# Altium schematic sheet [07]-PowerSupply.SchDoc: Powersupplies (part 4 of 4)
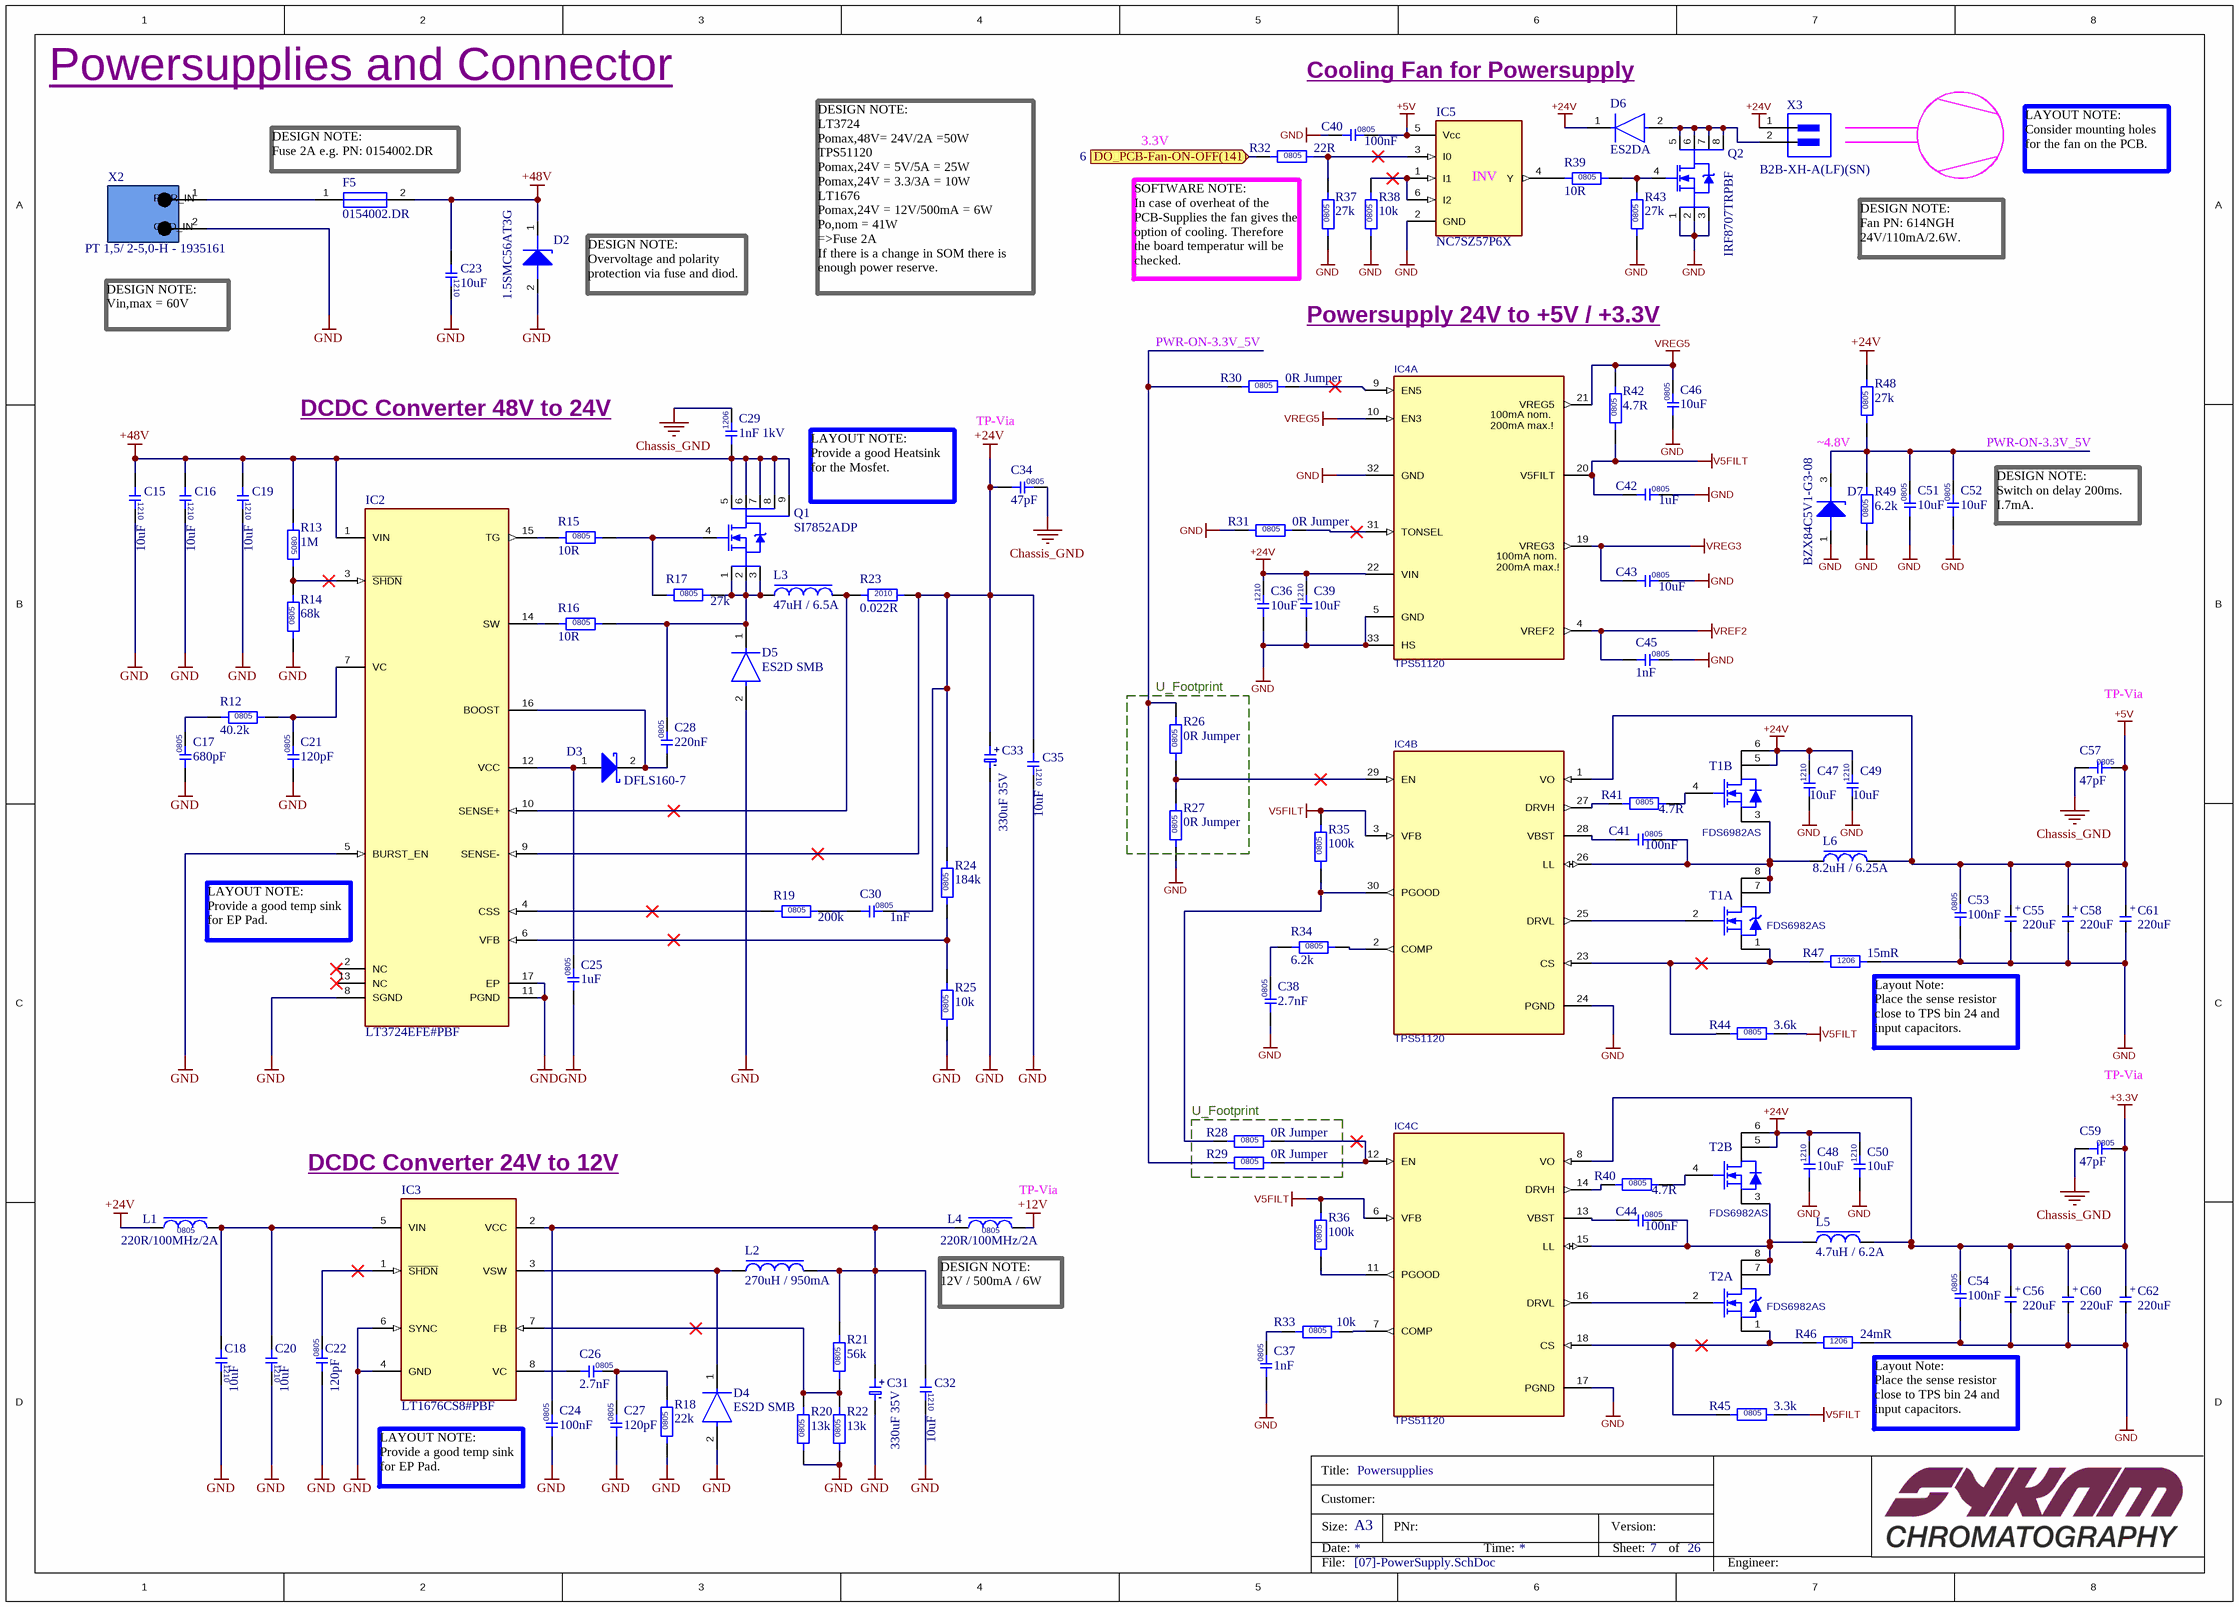
[diagram p3: [07]-PowerSupply.SchDoc]

## Library data of the parts (continued)
R40-R42 = R_4.7R_RC0805FR-074R7L: YAGEO - RC0805FR-074R7L - SMD Chip Resistor, 0805 [2012 Metric], 4.7 ohm, RC Series, 150 V, Thick Film, 125 mW; Power Rating: 125mW; Tolerance: 1%; Temperature Coefficient: 200ppm/°C; Voltage Rating: 150V; Supplier 1: Digi-Key; Manufacturer: Yageo; Manufacturer Part Number: RC0805FR-074R7L; RoHS: Yes; Category: Chip SMD Resistors; Stock 1: 232712; Pricing 1: 1=0,10000, 10=0,07200, 100=0,02770, 1000=0,01219, 2500=0,01053 (USD); Case/Package: 0805; Weight: 0.000194oz; Case Code (Imperial): 0805; Case Code (Metric): 2012; Min Operating Temperature: -55°C; Max Operating Temperature: 155°C; Packaging: Tape and Reel; Resistance: 4.7R; Max Power Dissipation: 125mW; Package Quantity: 1; Termination: SMD/SMT; Composition: Thick Film; Number of Terminations: 2; Military Standard: Not; Features: Moisture Resistant; Length: 2mm; Height: 0.5mm; Width: 1.25mm; Depth: 1.25mm; REACH SVHC: Unknown; Lead Free: Lead Free; ComponentLink1URL: https://datasheet.ciiva.com/11819/0900766b8106beab-11819877.pdf?src-supplier=RSComponents; ComponentLink1Description: https://datasheet.ciiva.com/11819/0900766b8106beab-11819877.pdf?src-supplier=RSComponents; ComponentLink2URL: https://datasheet.ciiva.com/16769/rc0805-16769447.pdf?src-supplier=Future+Electronics; ComponentLink2Description: https://datasheet.ciiva.com/16769/rc0805-16769447.pdf?src-supplier=Future+Electronics; ComponentLink3URL: https://datasheet.ciiva.com/2459/pyu-r-int-thick-7-2459640.pdf?src-supplier=Digi-Key; ComponentLink3Description: https://datasheet.ciiva.com/2459/pyu-r-int-thick-7-2459640.pdf?src-supplier=Digi-Key; ComponentLink4URL: https://datasheet.ciiva.com/2459/pyu-r-int-thick-7-2459641.pdf?src-supplier=Digi-Key; ComponentLink4Description: https://datasheet.ciiva.com/2459/pyu-r-int-thick-7-2459641.pdf?src-supplier=Digi-Key; ComponentLink5URL: https://datasheet.ciiva.com/2459/pyu-r-int-thick-7-2459642.pdf?src-supplier=Digi-Key; ComponentLink5Description: https://datasheet.ciiva.com/2459/pyu-r-int-thick-7-2459642.pdf?src-supplier=Digi-Key; Supplier Part Number 1: 311-4.70CRCT-ND
R44 = R_3.6k_RC0805FR-073K6L: RES SMD 3.6K OHM 1% 1/8W 0805; Manufacturer: Yageo; Resistance: 3.6kR; Power Rating: 125mW; Temperature Coefficient: 100ppm/°C; Voltage Rating: 150V; Supplier 1: Digi-Key; Manufacturer Part Number: RC0805FR-073K6L; RoHS: Yes; Category: Chip SMD Resistors; Stock 1: 49048; Pricing 1: 1=0,10000, 10=0,04000, 100=0,01630, 1000=0,00731, 2500=0,00635 (USD); Mount: Surface Mount; Case/Package: 0805; Case Code (Metric): 2012; Case Code (Imperial): 0805; Min Operating Temperature: -55°C; Max Operating Temperature: 155°C; Tolerance: 1%; Packaging: Tape and Reel; Composition: Thick Film; Termination: SMD/SMT; Voltage Rating (DC): 150V; Max Power Dissipation: 125mW; Number of Terminations: 2; Military Standard: Not; Package Quantity: 1; Features: Moisture Resistant; Length: 2mm; Height: 0.5mm; Width: 0.049inch; Depth: 1.25mm; Lead Free: Lead Free; ComponentLink1URL: https://datasheet.ciiva.com/11819/0900766b8106beab-11819852.pdf?src-supplier=RSComponents; ComponentLink1Description: https://datasheet.ciiva.com/11819/0900766b8106beab-11819852.pdf?src-supplier=RSComponents; ComponentLink2URL: https://datasheet.ciiva.com/15189/getdatasheetpartid-327996-15189964.pdf?src-supplier=Verical; ComponentLink2Description: https://datasheet.ciiva.com/15189/getdatasheetpartid-327996-15189964.pdf?src-supplier=Verical; ComponentLink3URL: https://datasheet.ciiva.com/2509/pyu-r-int-thick-7-2509501.pdf?src-supplier=Digi-Key; ComponentLink3Description: https://datasheet.ciiva.com/2509/pyu-r-int-thick-7-2509501.pdf?src-supplier=Digi-Key; ComponentLink4URL: https://datasheet.ciiva.com/2509/pyu-r-int-thick-7-2509502.pdf?src-supplier=Digi-Key; ComponentLink4Description: https://datasheet.ciiva.com/2509/pyu-r-int-thick-7-2509502.pdf?src-supplier=Digi-Key; ComponentLink5URL: https://datasheet.ciiva.com/17041/rc0805-17041166.pdf?src-supplier=Future+Electronics; ComponentLink5Description: https://datasheet.ciiva.com/17041/rc0805-17041166.pdf?src-supplier=Future+Electronics; ComponentLink6URL: https://datasheet.ciiva.com/2509/pyu-r-int-thick-7-2509503.pdf?src-supplier=Digi-Key; ComponentLink6Description: https://datasheet.ciiva.com/2509/pyu-r-int-thick-7-2509503.pdf?src-supplier=Digi-Key; Supplier Part Number 1: 311-3.60KCRCT-ND
R45 = R_3.3k_RC0805FR-073K3L: Res Thick Film 0805 3.3K Ohm 1% 0.125W(1/8W) ±100ppm/C Epoxy Pad SMD T/R; Manufacturer: Yageo; Resistance: 3.3kR; Temperature Coefficient: 100ppm/°C; Power Rating: 125mW; Voltage Rating: 150V; Supplier 1: Digi-Key; Manufacturer Part Number: RC0805FR-073K3L; RoHS: Yes; Category: Chip SMD Resistors; Stock 1: 73579; Pricing 1: 1=0,10000, 10=0,04000, 100=0,01630, 1000=0,00731, 2500=0,00635 (USD); Case/Package: 0805; Weight: 0.000194oz; Case Code (Metric): 2012; Case Code (Imperial): 0805; Min Operating Temperature: -55°C; Max Operating Temperature: 155°C; Tolerance: 1%; Packaging: Tape and Reel; Composition: Thick Film; Number of Terminations: 2; Termination: SMD/SMT; Package Quantity: 1; Features: Moisture Resistant; Max Power Dissipation: 125mW; Length: 2mm; Height: 0.5mm; Width: 0.049inch; Depth: 1.25mm; Lead Free: Lead Free; REACH SVHC: No SVHC; ComponentLink1URL: https://datasheet.ciiva.com/7941/444164-7941782.pdf?src-supplier=Element14; ComponentLink1Description: https://datasheet.ciiva.com/7941/444164-7941782.pdf?src-supplier=Element14; ComponentLink2URL: https://datasheet.ciiva.com/7941/444164-7941783.pdf?src-supplier=Element14; ComponentLink2Description: https://datasheet.ciiva.com/7941/444164-7941783.pdf?src-supplier=Element14; ComponentLink3URL: https://datasheet.ciiva.com/2457/pyu-r-int-thick-7-2457992.pdf?src-supplier=Digi-Key; ComponentLink3Description: https://datasheet.ciiva.com/2457/pyu-r-int-thick-7-2457992.pdf?src-supplier=Digi-Key; ComponentLink4URL: https://datasheet.ciiva.com/2457/pyu-r-int-thick-7-2457994.pdf?src-supplier=Digi-Key; ComponentLink4Description: https://datasheet.ciiva.com/2457/pyu-r-int-thick-7-2457994.pdf?src-supplier=Digi-Key; ComponentLink5URL: https://datasheet.ciiva.com/16747/rc0805-16747115.pdf?src-supplier=Future+Electronics; ComponentLink5Description: https://datasheet.ciiva.com/16747/rc0805-16747115.pdf?src-supplier=Future+Electronics; ComponentLink6URL: https://datasheet.ciiva.com/46447/444164-46447579.pdf?src-supplier=Element14; ComponentLink6Description: https://datasheet.ciiva.com/46447/444164-46447579.pdf?src-supplier=Element14; ComponentLink7URL: https://datasheet.ciiva.com/2457/pyu-r-int-thick-7-2457993.pdf?src-supplier=Digi-Key; ComponentLink7Description: https://datasheet.ciiva.com/2457/pyu-r-int-thick-7-2457993.pdf?src-supplier=Digi-Key; ComponentLink8URL: https://datasheet.ciiva.com/12577/rc0805-12577341.pdf?src-supplier=Mouser; ComponentLink8Description: https://datasheet.ciiva.com/12577/rc0805-12577341.pdf?src-supplier=Mouser; Supplier Part Number 1: 311-3.30KCRCT-ND
R46 = R_24mR_CRL1206-FV-R024ELF: Current Sense Resistors - SMD 0.024ohm 1%; Manufacturer: Bourns; Temperature Coefficient: 400ppm/°C; Power Rating: 250mW; Supplier 1: Mouser; Manufacturer Part Number: CRL1206-FV-R024ELF; RoHS: Yes; Category: Uncategorized; Case/Package: 1206; Weight: 0.000353oz; Case Code (Imperial): 1206; Case Code (Metric): 3216; Termination: SMD/SMT; Resistor Type: Thick Film; Resistance: 24mR; Packaging: Tape and Reel; Tolerance: 1%; Length: 3.2mm; Height: 0.6mm; Width: 1.6mm; ComponentLink1URL: https://datasheet.ciiva.com/5474/crl-5474006.pdf?src-supplier=Mouser; ComponentLink1Description: https://datasheet.ciiva.com/5474/crl-5474006.pdf?src-supplier=Mouser; Supplier Part Number 1: 652-CRL1206FVR024ELF
R47 = R_15mR_WSL1206R0150FEA: Res Metal Strip 1206 0.015 Ohm 1% 1/4W 75ppm/C Molded SMD SMD Embossed Plastic T/R; Manufacturer: Vishay Dale; Temperature Coefficient: 75ppm/°C; Power Rating: 250mW; Voltage Rating: 60mV; Supplier 1: Farnell; Manufacturer Part Number: WSL1206R0150FEA; RoHS: Yes; Category: Chip SMD Resistors; Stock 1: 4000; Pricing 1: 4000=0,33100 (EUR); Mount: Surface Mount; Case/Package: 1206; Number of Pins: 2; Weight: 0.000571oz; Contact Plating: Tin,Matte; Case Code (Imperial): 1206; Case Code (Metric): 3216; Min Operating Temperature: -65°C; Max Operating Temperature: 170°C; Resistance: 15mR; Tolerance: 1%; Resistor Type: Metal Strip,Metal Film; Packaging: Tape and Reel; Package Quantity: 4000; Termination: SMD/SMT; Voltage Rating (DC): 60mV; Length: 3.2mm; Height: 0.635mm; Width: 1.6mm; Depth: 1.6mm; Radiation Hardening: No; Lead Free: Lead Free; REACH SVHC: Unknown; ComponentLink1URL: https://datasheet.ciiva.com/7109/smpack-7109840.pdf?src-supplier=Newark; ComponentLink1Description: https://datasheet.ciiva.com/7109/smpack-7109840.pdf?src-supplier=Newark; ComponentLink2URL: https://datasheet.ciiva.com/5469/wsl-101914-5469061.pdf?src-supplier=Mouser; ComponentLink2Description: https://datasheet.ciiva.com/5469/wsl-101914-5469061.pdf?src-supplier=Mouser; ComponentLink3URL: https://datasheet.ciiva.com/16341/wsl-16341093.pdf?src-supplier=Future+Electronics; ComponentLink3Description: https://datasheet.ciiva.com/16341/wsl-16341093.pdf?src-supplier=Future+Electronics; ComponentLink4URL: https://datasheet.ciiva.com/17187/wsl-17187454.pdf?src-supplier=Avnet+Europe; ComponentLink4Description: https://datasheet.ciiva.com/17187/wsl-17187454.pdf?src-supplier=Avnet+Europe; Supplier Part Number 1: 2368767
T1 T2 = T-Fairchild-FDS6982AS-N: FAIRCHILD SEMICONDUCTOR   FDS6982AS   MOSFET, NN-CH, 30V, 8.6A, 8-SOIC, RL; Manufacturer: ON Semiconductor / Fairchild; PCBChecked: initials after Checked; Rise Time: 7ns; Fall Time: 3ns; Drain to Source Resistance: 11mR; Power Dissipation: 2W; Turn-Off Delay Time: 24ns; Gate to Source Voltage (Vgs): 20V; Input Capacitance: 610pF; Number of Elements: 2; Rds On Max: 28mR; Turn-On Delay Time: 12ns; Threshold Voltage: 1.9V; Nominal Vgs: 1.4V; FET Type: 2 N-Channel; Recovery Time: 19ns; Manufacturer Name: Fairchild; Manufacturer Part No.: FDS6982AS; IPC7352C: initials after Checked; SCHChecked: initials after Checked; Supplier 1: Farnell; Manufacturer Part Number: FDS6982AS; RoHS: Yes; Category: MOSFETs; Stock 1: 6507; Pricing 1: 5=0,75600, 50=0,67400, 100=0,43500, 500=0,39200, 1000=0,34800 (EUR); Mount: Surface Mount; Case/Package: SOIC; Number of Pins: 8; Weight: 0.187g; Contact Plating: Tin,Matte; Min Operating Temperature: -55°C; Max Operating Temperature: 150°C; Package Quantity: 1; Packaging: Tape and Reel; Continuous Drain Current (ID): 8.6A; Max Power Dissipation: 2W; Drain to Source Voltage (Vdss): 30V; Drain to Source Breakdown Voltage: 30V; On-State Resistance: 28MR; Voltage Rating (DC): 30V; Current Rating: 8.6A; Length: 5mm; Height: 1.5mm; Width: 3.99mm; Radiation Hardening: No; REACH SVHC: No SVHC; Lead Free: Lead Free; ComponentLink1URL: https://datasheet.ciiva.com/6386/fds6982as-6386529.pdf?src-supplier=Digi-Key; ComponentLink1Description: https://datasheet.ciiva.com/6386/fds6982as-6386529.pdf?src-supplier=Digi-Key; ComponentLink2URL: https://datasheet.ciiva.com/15137/getdatasheetpartid-60181-15137249.pdf?src-supplier=Verical; ComponentLink2Description: https://datasheet.ciiva.com/15137/getdatasheetpartid-60181-15137249.pdf?src-supplier=Verical; ComponentLink3URL: https://datasheet.ciiva.com/14170/fds6982as-eng-tds-14170930.pdf?src-supplier=Distrelec; ComponentLink3Description: https://datasheet.ciiva.com/14170/fds6982as-eng-tds-14170930.pdf?src-supplier=Distrelec; ComponentLink4URL: https://datasheet.ciiva.com/4441/fds6982as-111180-4441914.pdf?src-supplier=Mouser; ComponentLink4Description: https://datasheet.ciiva.com/4441/fds6982as-111180-4441914.pdf?src-supplier=Mouser; ComponentLink5URL: https://datasheet.ciiva.com/8114/fds6982as-8114629.pdf?src-supplier=Avnet; ComponentLink5Description: https://datasheet.ciiva.com/8114/fds6982as-8114629.pdf?src-supplier=Avnet; ComponentLink6URL: https://datasheet.ciiva.com/22705/192146-22705126.pdf?src-supplier=Element14; ComponentLink6Description: https://datasheet.ciiva.com/22705/192146-22705126.pdf?src-supplier=Element14; ComponentLink7URL: https://datasheet.ciiva.com/26141/fds6982as-26141769.pdf?src-supplier=Avnet+Europe; ComponentLink7Description: https://datasheet.ciiva.com/26141/fds6982as-26141769.pdf?src-supplier=Avnet+Europe; Supplier Part Number 1: 1495216
X2 = CON_1935161: Conn Terminal Blocks 2 POS 5mm Solder ST Thru-Hole 16A; Manufacturer: Phoenix Contact; Connector Type: Screw; Voltage Rating (DC): 320V; Max Supply Voltage: 250V; Current Rating: 17.5A; Number of Poles: 2; Number of Levels: 1; Current: 18A; Voltage: 300V; Wire Gauge (Max): 26AWG; Wire Gauge (Min): 12AWG; Approvals: UL; Supplier 1: Digi-Key; Manufacturer Part Number: 1935161; RoHS: Yes; Category: Terminal Blocks; Stock 1: 59961; Pricing 1: 1=0,43000, 10=0,41100, 50=0,39280, 100=0,38200, 250=0,35700, 500=0,32844, 1000=0,30350 (USD); Mount: Through Hole; Number of Pins: 2; Weight: 0.067021oz; Contact Material: Copper,Tin; Insulation Material: Nylon; Housing Material: Polyamide; Housing Color: Green; Color: Green; Material: Nylon; Number of Rows: 1; Max Current Rating: 16A; Voltage Rating: 250V; Package Quantity: 250; Packaging: Bulk; Number of Positions: 2; Number of Positions Per Level: 2; Termination: Solder; Number of Contacts: 2; Number of Circuits: 2; Orientation: Straight; Length: 9mm; Height: 11.3mm; Width: 14.9mm; Pitch: 5mm; Depth: 9mm; Wire/Cable Gauge: 26AWG; Radiation Hardening: No; Flammability Rating: UL94 V-0; Lead Free: Lead Free; REACH SVHC: Unknown; ComponentLink1URL: https://datasheet.ciiva.com/15169/getdatasheetpartid-177903-15169663.pdf?src-supplier=Verical; ComponentLink1Description: https://datasheet.ciiva.com/15169/getdatasheetpartid-177903-15169663.pdf?src-supplier=Verical; ComponentLink2URL: https://datasheet.ciiva.com/16047/1935161-16047247.pdf?src-supplier=Onlinecomponents.com; ComponentLink2Description: https://datasheet.ciiva.com/16047/1935161-16047247.pdf?src-supplier=Onlinecomponents.com; ComponentLink3URL: https://datasheet.ciiva.com/824/combiconcompact5-0mmseries-824222.pdf?src-supplier=Digi-Key; ComponentLink3Description: https://datasheet.ciiva.com/824/combiconcompact5-0mmseries-824222.pdf?src-supplier=Digi-Key; Supplier Part Number 1: 277-1667-ND
X3 = CON_2p_B2B-XH-A(LF)(SN): Conn Shrouded Header (4 Sides) HDR 2 POS 2.5mm Solder ST Thru-Hole Box; Manufacturer: JST; Number of Positions: 2; Connector Type: Male Pin; Current Rating: 3A; Contact Resistance: 20mR; Voltage Rating: 250V; Insulation Resistance: 1GR; Wire/Cable Gauge: 22AWG; Supplier 1: Farnell; Manufacturer Part Number: B2B-XH-A(LF)(SN); RoHS: Yes; Category: FFC / FPC; Stock 1: 138104; Pricing 1: 100=0,06890, 1000=0,06030, 2500=0,05600, 5000=0,05160, 10000=0,05030, 20000=0,04930 (EUR); Mount: Through Hole; Contact Plating: Tin,Copper,Lead; Color: Natural; Contact Material: Brass; Housing Color: White; Housing Material: Polyamide; Min Operating Temperature: -25°C; Max Operating Temperature: 85°C; Number of Rows: 1; Packaging: Bulk; Termination: Solder; Fastening Type: Detent; Max Current Rating: 3A; Voltage Rating (AC): 250V; Max Voltage Rating (AC): 250V; Number of Contacts: 2; Max Voltage Rating (DC): 250V; Orientation: Straight; Length: 7.4mm; Pitch: 2.5mm; Lead Pitch: 2.5mm; Depth: 5.75mm; REACH SVHC: No SVHC; Lead Free: Lead Free; ComponentLink1URL: https://datasheet.ciiva.com/26894/getdatasheetpartid-640357-26894434.pdf?src-supplier=Verical; ComponentLink1Description: https://datasheet.ciiva.com/26894/getdatasheetpartid-640357-26894434.pdf?src-supplier=Verical; ComponentLink2URL: https://datasheet.ciiva.com/11746/0900766b8082653e-11746979.pdf?src-supplier=RSComponents; ComponentLink2Description: https://datasheet.ciiva.com/11746/0900766b8082653e-11746979.pdf?src-supplier=RSComponents; ComponentLink3URL: https://datasheet.ciiva.com/26894/getdatasheetpartid-385291-26894760.pdf?src-supplier=Verical; ComponentLink3Description: https://datasheet.ciiva.com/26894/getdatasheetpartid-385291-26894760.pdf?src-supplier=Verical; ComponentLink4URL: https://datasheet.ciiva.com/8052/5448-8052024.pdf?src-supplier=Element14; ComponentLink4Description: https://datasheet.ciiva.com/8052/5448-8052024.pdf?src-supplier=Element14; ComponentLink5URL: https://datasheet.ciiva.com/20207/523653-20207167.pdf?src-supplier=Rapid+Electronics; ComponentLink5Description: https://datasheet.ciiva.com/20207/523653-20207167.pdf?src-supplier=Rapid+Electronics; Supplier Part Number 1: 1516276